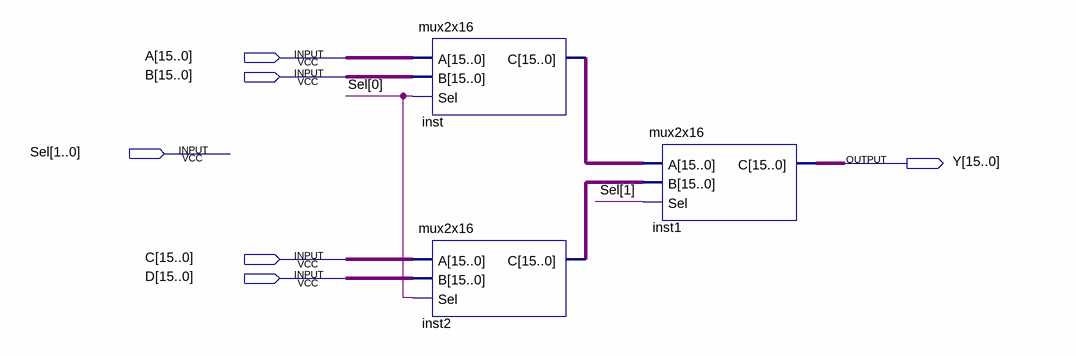
[diagram p0: schematic sheet]
// Quartus schematic mux4x16.bdf as structural Verilog: 3 symbols, 6 pins
module mux4x16 (
  input  [15:0] A,
  input  [15:0] B,
  input  [1:0] Sel,
  input  [15:0] C,
  input  [15:0] D,
  output [15:0] Y
);

  wire [15:0] inst2_c, inst_c;

  mux2x16 inst (.A(A), .B(B), .Sel(Sel[0]), .C(inst_c));
  mux2x16 inst2 (.A(C), .B(D), .Sel(Sel[0]), .C(inst2_c));
  mux2x16 inst1 (.A(inst_c), .B(inst2_c), .Sel(Sel[1]), .C(Y));
endmodule
